# Altium schematic sheet PlacaVGAEsquematico.SchDoc
size A4
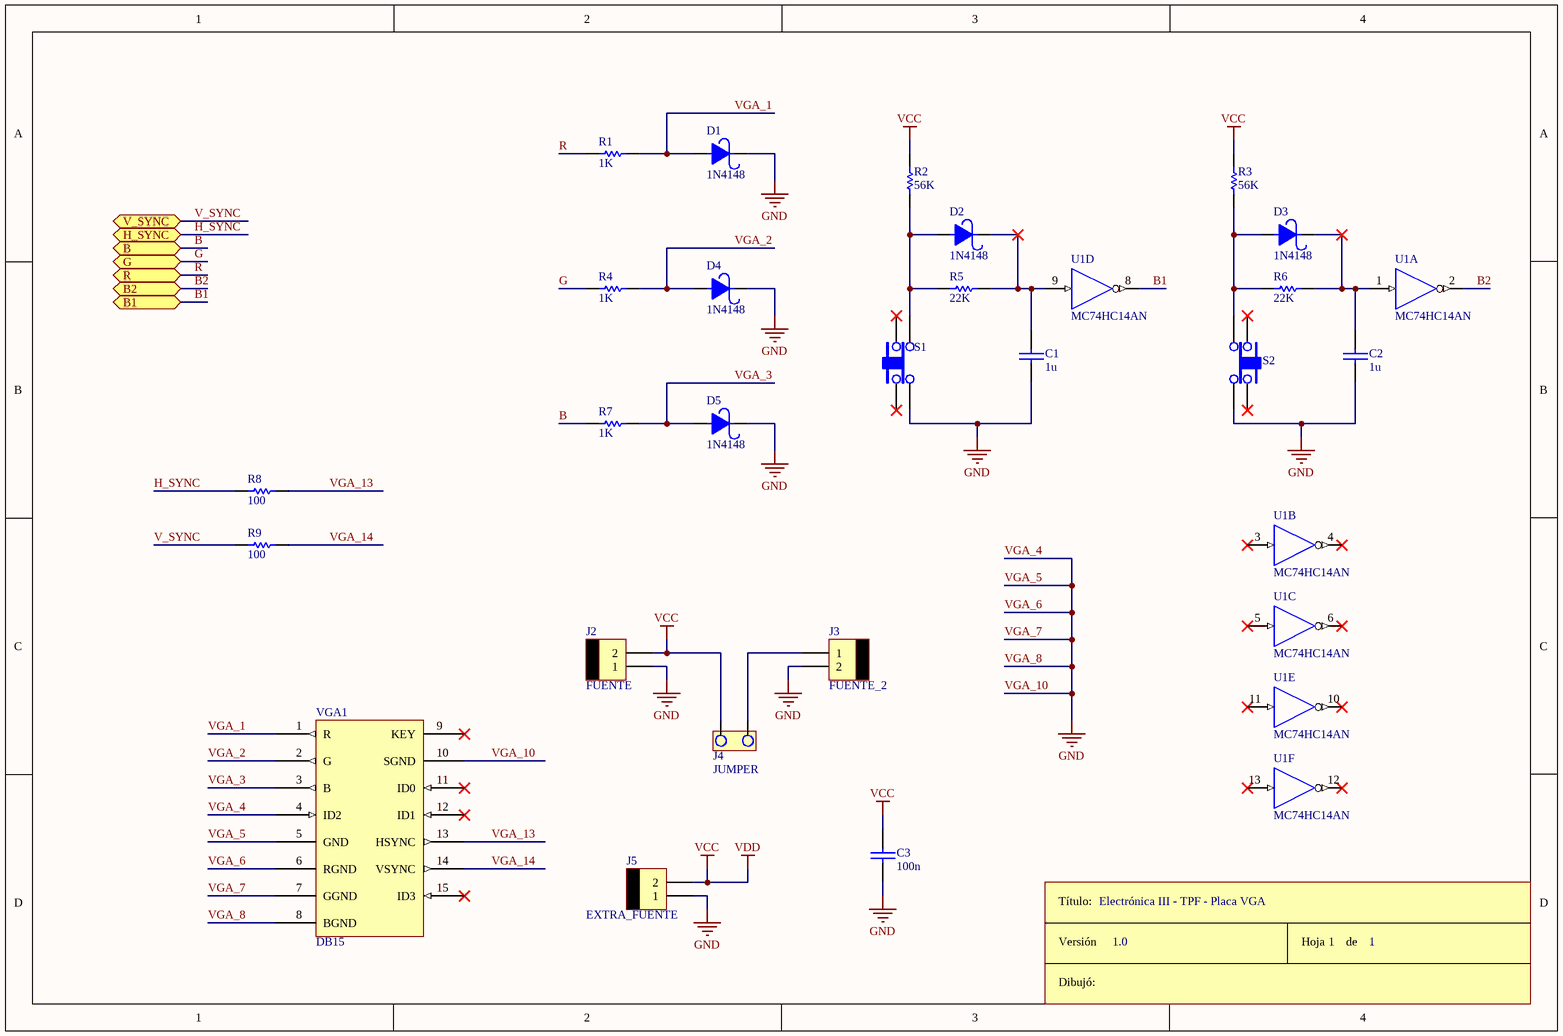
[diagram p0: PlacaVGAEsquematico.SchDoc]

## Parts
C1  1u  [CAP200]
C2  1u  [CAP200]
C3  100n  [CAP100]
D1  1N4148  [DO41]
D2  1N4148  [DO41]
D3  1N4148  [DO41]
D4  1N4148  [DO41]
D5  1N4148  [DO41]
J2  FUENTE  [MOLEX2]
J3  FUENTE_2  [MOLEX2]
J4  JUMPER  [JUMPER2]
J5  EXTRA_FUENTE  [MOLEX2]
R1  1K  [RES300]
R2  56K  [RES300]
R3  56K  [RES300]
R4  1K  [RES300]
R5  22K  [RES300]
R6  22K  [RES300]
R7  1K  [RES300]
R8  100  [RES300]
R9  100  [RES300]
ROT1  Rótulo  (value not drawn)
S1  TACT SWITCH  [TACTSWITCH]  (value not drawn)
S2  TACT SWITCH  [TACTSWITCH]  (value not drawn)
U1  MC74HC14AN  [646-06]  (parts A,B,C,D,E,F of 6)
VGA1  DB15  [DB15_DSUB]

## Ports
B, B1, B2, G, H_SYNC, R, V_SYNC

## Nets
VCC: C3.1 J2.2 J4.1 J5.2 R2.2 R3.2 U1.14(VDD)  [also labelled VDD]
VGA_10: C1.2 C2.2 C3.2 D1.2 D4.2 D5.2 J2.1 J3.2 J5.1 S1.2 S2.4 U1.7(GND) VGA1.4(ID2) VGA1.5(GND) VGA1.6(RGND) VGA1.7(GGND) VGA1.8(BGND) VGA1.10(SGND)  [also labelled GND, VGA_4, VGA_5, VGA_6, VGA_7, VGA_8]
B: R7.1 ; port B
B1: U1.8(Y) ; port B1
B2: U1.2(Y) ; port B2
G: R4.1 ; port G
H_SYNC: R8.1 ; port H_SYNC
R: R1.1 ; port R
V_SYNC: R9.1 ; port V_SYNC
VGA_1: D1.1 R1.2 VGA1.1(R)
VGA_2: D4.1 R4.2 VGA1.2(G)
VGA_3: D5.1 R7.2 VGA1.3(B)
VGA_13: R8.2 VGA1.13(HSYNC)
VGA_14: R9.2 VGA1.14(VSYNC)
NetC1_1: C1.1 D2.2 R5.2 U1.9(A)
NetC2_1: C2.1 D3.2 R6.1 U1.1(A)
NetD2_1: D2.1 R2.1 R5.1 S1.4
NetD3_1: D3.1 R3.1 R6.2 S2.2
NetJ3_1: J3.1 J4.2

Not connected (* = marked no-connect by the designer): S1 1* 3*; S2 1* 3*; U1 3(A)* 4(Y)* 5(A)* 6(Y)* 10(Y)* 11(A)* 12(Y)* 13(A)*; VGA1 9(KEY)* 11(ID0)* 12(ID1)* 15(ID3)*

## Notes on the sheet
- Electrónica III - TPF - Placa VGA
- 1.0
- 1
- (in symbol Rótulo) Título:; Versión; Hoja       de; Dibujó:

## Library data of the parts
C1-C3 = CAP
D1-D5 = DIODO SCHOTTKY
J2 J3 J5 = MOLEX2
R1-R9 = RES
U1 = MC74HC14AN: Hex Schmitt Trigger Inverter; Published: 17-Jul-2002; LatestRevisionDate: 06-Jun-2005; LatestRevisionNote: Stylized 3D Model Added; DatasheetVersion: 1989; PackageVersion: 1997; PackageReference: 646-06; Publisher: Altium Limited; PackageDescription: DIP; 14 Leads; Row Spacing 7.62 mm; Pitch 2.54 mm; ComponentLink1Description: Manufacturer Link; ComponentLink1URL: http://www.onsemi.com/site/products/parametrics/0,4446,247,00.html; ComponentLink2Description: Ibis Model; ComponentLink2URL: http://www.onsemi.com/pub/Collateral/MC54HC14AJ.IBS
VGA1 = DB15: DB15 VGA Male Connector